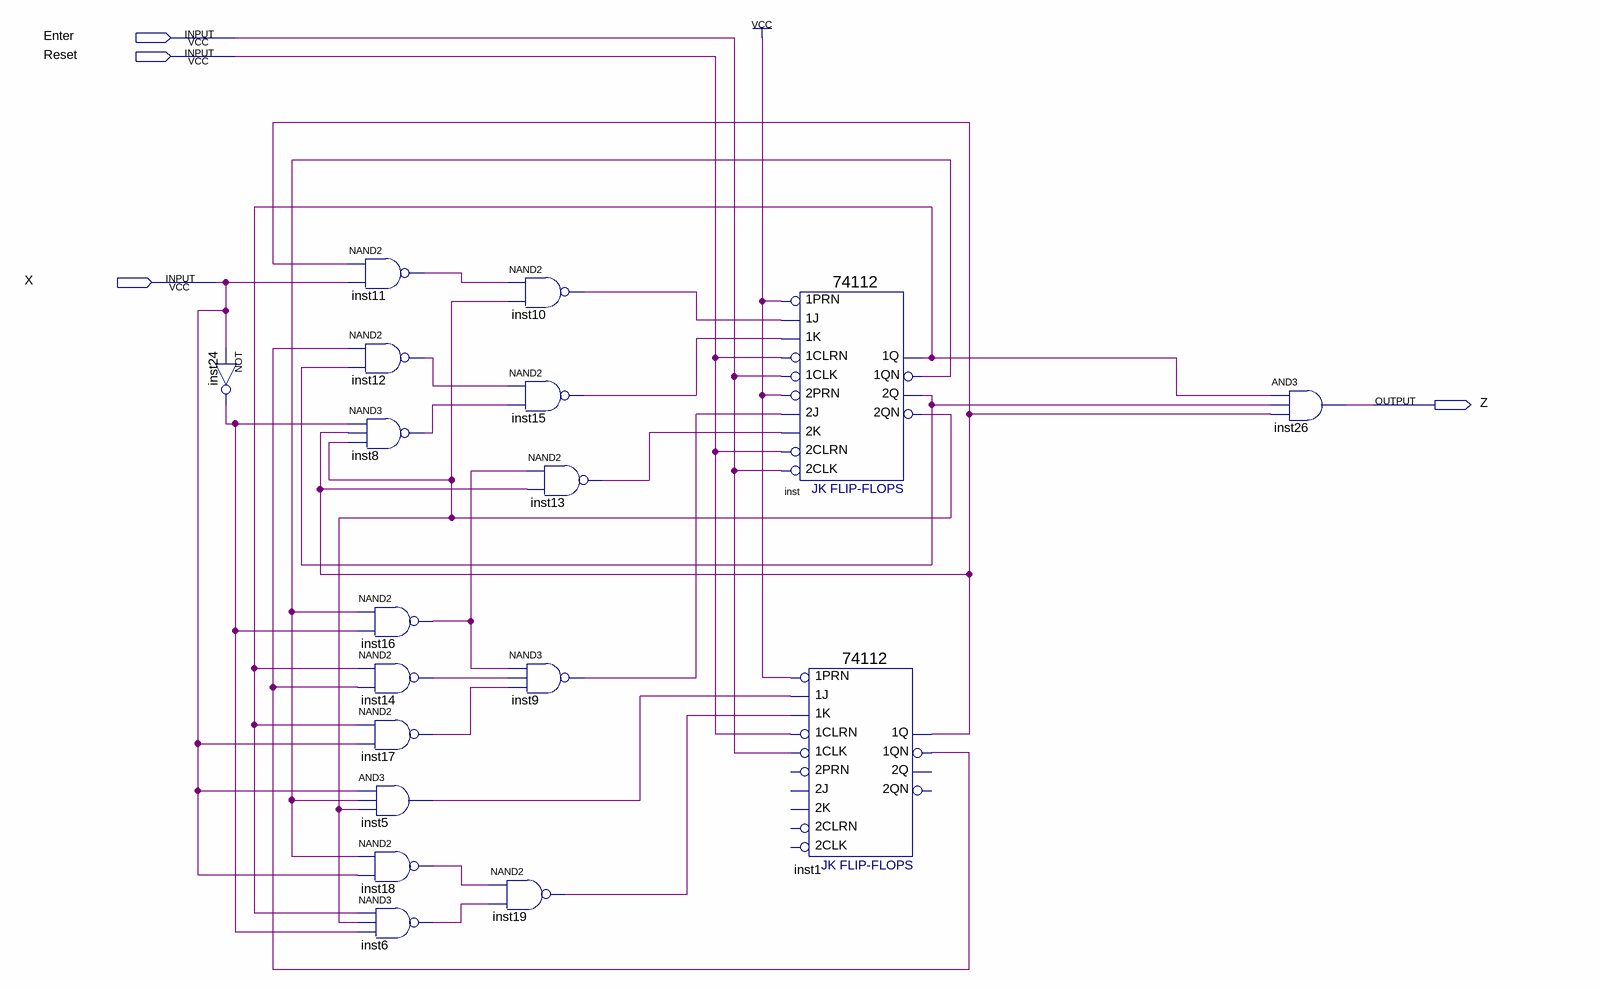
[diagram p0: schematic sheet]
// Quartus schematic Lock_controller.bdf as structural Verilog: 18 symbols, 4 pins
module Lock_controller (
  input  Enter,
  input  Reset,
  input  X,
  output Z
);

  wire inst1_1q, inst1_1qn, inst5_out, inst6_out, inst8_out, inst9_out, inst10_out, inst11_out, inst12_out,
       inst13_out, inst14_out, inst15_out, inst16_out, inst17_out, inst18_out, inst19_out, inst24_out,
       inst_1q, inst_1qn, inst_2q, inst_2qn;

  not inst24 (inst24_out, X);
  nand inst11 (inst11_out, inst1_1q, X);
  nand inst12 (inst12_out, inst1_1qn, inst_2q);
  nand inst8 (inst8_out, inst24_out, inst1_1q, inst_2qn);
  nand inst16 (inst16_out, inst_1qn, inst24_out);
  nand inst14 (inst14_out, inst_1q, inst1_1qn);
  nand inst17 (inst17_out, inst_1q, X);
  and inst5 (inst5_out, X, inst_1qn, inst_2qn);
  nand inst18 (inst18_out, inst_1qn, X);
  nand inst6 (inst6_out, inst_1q, inst_2qn, inst24_out);
  nand inst10 (inst10_out, inst11_out, inst_2qn);
  nand inst15 (inst15_out, inst12_out, inst8_out);
  nand inst13 (inst13_out, inst16_out, inst1_1q);
  nand inst9 (inst9_out, inst16_out, inst14_out, inst17_out);
  nand inst19 (inst19_out, inst18_out, inst6_out);
  \74112  inst (
    .\1K (inst15_out), .\1J (inst10_out), .\1PRN (1'b1), .\1CLK (Enter), .\1CLRN (Reset), .\2K (inst13_out),
    .\2J (inst9_out), .\2PRN (1'b1), .\2CLK (Enter), .\2CLRN (Reset), .\1QN (inst_1qn), .\2Q (inst_2q),
    .\1Q (inst_1q), .\2QN (inst_2qn));
  \74112  inst1 (
    .\1K (inst19_out), .\1J (inst5_out), .\1PRN (1'b1), .\1CLK (Enter), .\1CLRN (Reset), .\1QN (inst1_1qn),
    .\1Q (inst1_1q));  // open: 2K, 2J, 2PRN, 2CLK, 2CLRN, 2Q, 2QN
  and inst26 (Z, inst_1q, inst_2q, inst1_1q);
endmodule
